# Altium project Breadboard_PS_v1-0.PrjPcb
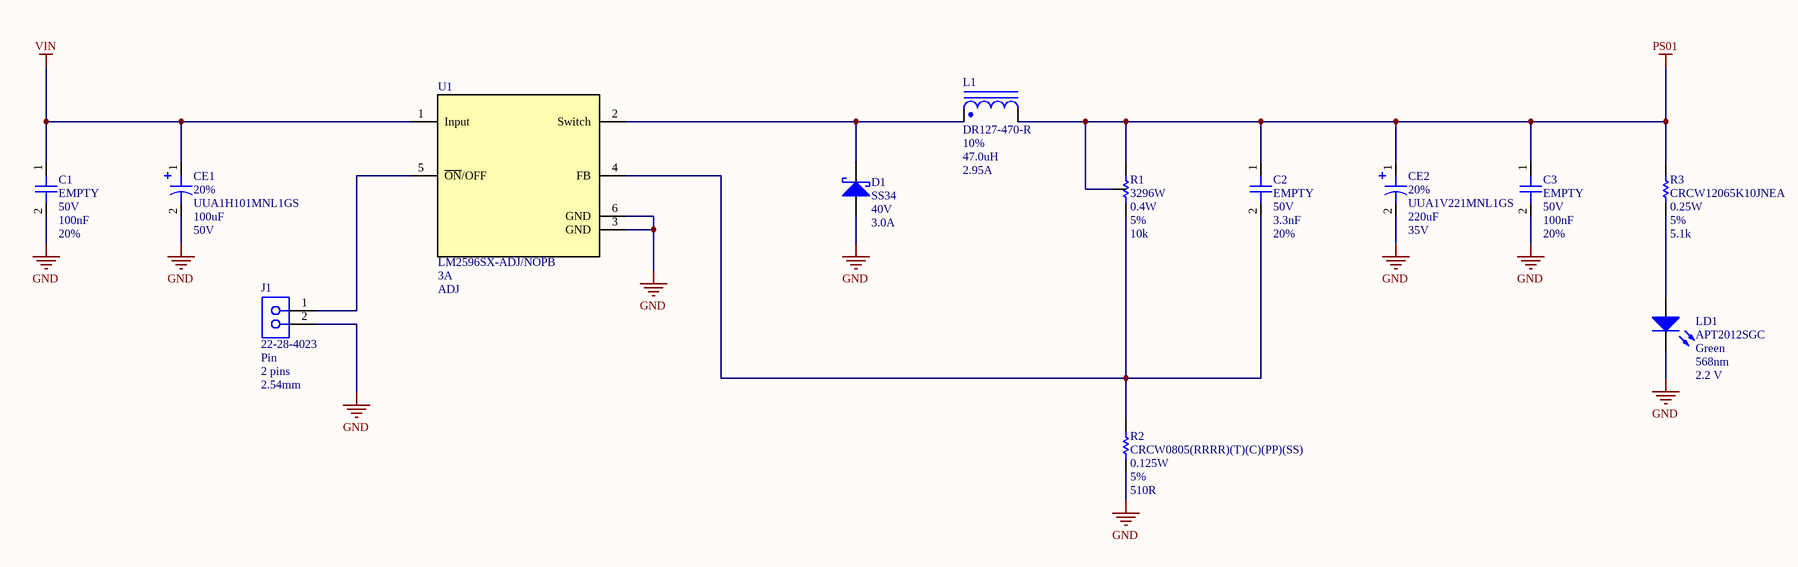
[diagram p0: BPS_PowerSupply_v1-0.SchDoc]
4 sheets, 29 parts. Net scope: global (net labels, ports and power ports of the same name join across sheets).
Board file: BPS_PCB_v1-0.PcbDoc
Sheets:
  BPS_Title_v1-0.SchDoc
  BPS_PowerSupply_v1-0.SchDoc
  BPS_PowerOutput_v1-0.SchDoc
  BPS_PowerInput_v1-0.SchDoc

## Sheet BPS_Title_v1-0.SchDoc
size A4

## Sheet BPS_PowerSupply_v1-0.SchDoc
size A3

### Parts
C1  value 100nF  PartNumber1: EMPTY  Voltage: 50V  Tolerance: 20%  [Cap0805]  (hidden comment: WCAP-CSGP (0805))
C2  value 3.3nF  PartNumber1: EMPTY  Voltage: 50V  Tolerance: 20%  [Cap0805]  (hidden comment: WCAP-CSGP (0805))
C3  value 100nF  PartNumber1: EMPTY  Voltage: 50V  Tolerance: 20%  [Cap0805]  (hidden comment: WCAP-CSGP (0805))
CE1  value 100uF  Tolerance: 20%  PartNumber1: UUA1H101MNL1GS  Voltage: 50V  [10.0dia(10.0)]  (hidden comment: 50V 100uF)
CE2  value 220uF  Tolerance: 20%  PartNumber1: UUA1V221MNL1GS  Voltage: 35V  [10.0dia(10.0)]  (hidden comment: 35V 220uF)
D1  Vrrm: 40V  If: 3.0A  [DO-214AA]  (hidden comment: SS34)
J1  Type: Pin  Pins: 2 pins  Pitch: 2.54mm  [CONSIL02STRMALE_100_100]  (hidden comment: 22-28-4023)
L1  value 47.0uH  PartNumber1: DR127-470-R  Tolerance: 10%  Current: 2.95A  [DR127]  (hidden comment: DR127)
LD1  Colour: Green  Wavelength: 568nm  Vled: 2.2 V  [LED0805]  (hidden comment: APT2012SGC)
R1  value 10k  Power: 0.4W  Tolerance: 5%  [3296W]  (hidden comment: 3296W)
R2  value 510R  PartNumber1: CRCW0805(RRRR)(T)(C)(PP)(SS)  Power: 0.125W  Tolerance: 5%  [RES0805]  (hidden comment: Chip Resistor)
R3  value 5.1k  PartNumber1: CRCW12065K10JNEA  Power: 0.25W  Tolerance: 5%  [RES1206]  (hidden comment: Chip Resistor)
U1  Current: 3A  Voltage: ADJ  [TO-263-5]  (hidden comment: LM2596SX-ADJ/NOPB)

### Nets
GND: C1.2 C3.2 CE1.2 CE2.2 D1.A J1.2 LD1.K R2.1 U1.3(GND) U1.6(GND)
PS01: C2.1 C3.1 CE2.1 L1.2 R1.2 R1.3 R3.2
VIN: C1.1 CE1.1 U1.1(Input)
NetC2_2: C2.2 R1.1 R2.2 U1.4(FB)
NetD1_K: D1.K L1.1 U1.2(Switch)
NetJ1_1: J1.1 U1.5(~{ON}/OFF)
NetLD1_A: LD1.A R3.1

### Notes on the sheet
- Title
- Author
- Checked By
- Size:
- Revision:
- A3
- Date:
- Project
- Time:
- Sheet
- of
- File:

### Library data of the parts
C1-C3 = WCAP-CSGP (0805): Surface Mount Multilayer Ceramic Chip Capacitors  for Commercial Applications; Manufacturer1: Wurth; Published: 19-Jun-2016; LatestRevisionDate: 19-Jun-2016; Publisher: Lucas Moraes; PackageReference: CAP0805; PackageDescription: CAP0805;2 Leads
CE1 = 50V 100uF: Electrolytic Capacitor SMD; Manufacturer1: Nichicon; Code: 101; Published: 05-Sep-2021; LatestRevisionDate: 05-Sep-2021; PackageReference: 8.0dia(10.0); Publisher: Lucas Moraes; PackageDescription: 10.0dia(10.0)2 leads; LatestRevisionNote: Created
CE2 = 35V 220uF: Electrolytic Capacitor SMD; Manufacturer1: Nichicon; Code: 221; Published: 06-Sep-2021; LatestRevisionDate: 06-Sep-2021; PackageReference: 10.0dia(10.0); Publisher: Lucas Moraes; PackageDescription: 10.0dia(10.0);2 leads; LatestRevisionNote: Created
D1 = SS34: Schottky Barrier Rectifiers 40V 3.0A; Manufacturer1: On Semiconductor; Vf: 0.85V; Published: 24-May-2022; LatestRevisionDate: 20-Jun-2016; PackageReference: DO-214AA; Publisher: Lucas Moraes; PackageDescription: DO-214AA; 2 Leads; PartNumber1: SS34
J1 = 22-28-4023: Headers & Wire Housings 02 MODII HDR SRST B/A .100CL; Manufacturer1: Molex; LastRevisionNote: Created; Gender: Male; Published: 15-Set-2017; LatestRevisionDate: 27-Mar-2023; PackageReference: CONSIL02STRMALE_100_100; Publisher: Lucas Moraes; PackageDescription: CONSIL02STRMALE_100_100; 2 Leads; PartNumber1: 22-28-4023
L1 = DR127: High power density, high efficiency, low profile shielded drum core power inductors; Manufacturer1: Coiltronics / Eaton; LatestRevisionDate: 05-Apr-2023; PackageReference: DR127; Publisher: Lucas Moraes; PackageDescription: DR127; 2 Leads; Published: 05-Apr-2023; Datasheet: https://br.mouser.com/datasheet/2/87/eaton-dr-high-power-density-high-efficiency-shield-1608690.pdf
LD1 = APT2012SGC: Standard LEDs - SMD 0805 Green; Manufacturer1: Kingbright; LastRevisionNote: Created; Published: 29-Dec-2016; PackageReference: LED0805; Publisher: Lucas Moraes; PackageDescription: LED0805; 2 leads; LastRevision: 29-Dec-2016; Datasheet: http://www.us.kingbright.com/images/catalog/SPEC/APT2012SGC.pdf; PartNumber1: APT2012SGC
R1 = 3296W: Trimmer Resistors - Through Hole 3/8" 100Kohms Sealed Vertical Adjust; Manufacturer1: Bourns; Published: 22-May-2017; LatestRevisionDate: 22-May-2017; PackageReference: 3296W; Publisher: Lucas Moraes; PackageDescription: 3386F; 3 Leads; PartNumber1: 3296W
R2 = CRCW0805: Thick Film Chip Resistors with CECC Approval,  available with Established Reliability; LatestRevisionDate: 06-May-2016; PackageReference: 0805; Publisher: Lucas Moraes; PackageDescription: SMD 0805; 2 Leads; Published: 06-May-2016
R3 = CRCW1206: Thick Film Chip Resistors with CECC Approval,  available with Established Reliability; LatestRevisionDate: 06-May-2016; PackageReference: 1206; Publisher: Lucas Moraes; PackageDescription: SMD 1206; 2 Leads; Published: 06-May-2016
U1 = LM2596SX-ADJ/NOPB: Switching Voltage Regulators 4V to 40V, 3A Step-Up Wide Vin Flyback Regulator 5-DDPAK/TO-263 -40 to 125; Manufacturer1: Texas Instruments; Published: 09-Agu-2022; LatestRevisionDate: 09-Agu-2022; LatestRevisionNote: Created; PackageReference: TO-263-5; Publisher: Lucas Moraes; PackageDescription: TO-263-5;5 Leads; PartNumber1: LM2596SX-ADJ/NOPB

## Sheet BPS_PowerOutput_v1-0.SchDoc
size A3
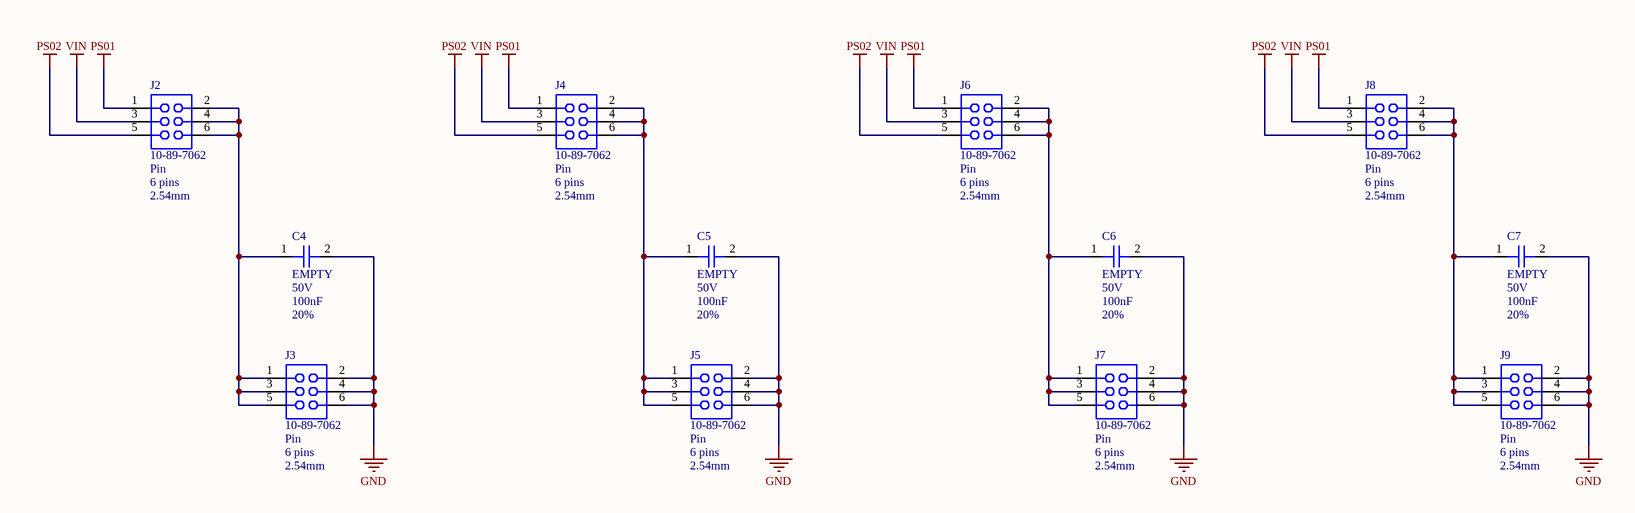
[diagram p1: BPS_PowerOutput_v1-0.SchDoc]

### Parts
C4  value 100nF  PartNumber1: EMPTY  Voltage: 50V  Tolerance: 20%  [Cap0805]  (hidden comment: WCAP-CSGP (0805))
C5  value 100nF  PartNumber1: EMPTY  Voltage: 50V  Tolerance: 20%  [Cap0805]  (hidden comment: WCAP-CSGP (0805))
C6  value 100nF  PartNumber1: EMPTY  Voltage: 50V  Tolerance: 20%  [Cap0805]  (hidden comment: WCAP-CSGP (0805))
C7  value 100nF  PartNumber1: EMPTY  Voltage: 50V  Tolerance: 20%  [Cap0805]  (hidden comment: WCAP-CSGP (0805))
J2  Type: Pin  Pins: 6 pins  Pitch: 2.54mm  [CONDIL06STRMALE_100_100]  (hidden comment: 10-89-7062)
J3  Type: Pin  Pins: 6 pins  Pitch: 2.54mm  [CONDIL06STRMALE_100_100]  (hidden comment: 10-89-7062)
J4  Type: Pin  Pins: 6 pins  Pitch: 2.54mm  [CONDIL06STRMALE_100_100]  (hidden comment: 10-89-7062)
J5  Type: Pin  Pins: 6 pins  Pitch: 2.54mm  [CONDIL06STRMALE_100_100]  (hidden comment: 10-89-7062)
J6  Type: Pin  Pins: 6 pins  Pitch: 2.54mm  [CONDIL06STRMALE_100_100]  (hidden comment: 10-89-7062)
J7  Type: Pin  Pins: 6 pins  Pitch: 2.54mm  [CONDIL06STRMALE_100_100]  (hidden comment: 10-89-7062)
J8  Type: Pin  Pins: 6 pins  Pitch: 2.54mm  [CONDIL06STRMALE_100_100]  (hidden comment: 10-89-7062)
J9  Type: Pin  Pins: 6 pins  Pitch: 2.54mm  [CONDIL06STRMALE_100_100]  (hidden comment: 10-89-7062)

### Nets
GND: C4.2 C5.2 C6.2 C7.2 J3.2 J3.4 J3.6 J5.2 J5.4 J5.6 J7.2 J7.4 J7.6 J9.2 J9.4 J9.6
PS01: J2.1 J4.1 J6.1 J8.1
PS02: J2.5 J4.5 J6.5 J8.5
VIN: J2.3 J4.3 J6.3 J8.3
NetC4_1: C4.1 J2.2 J2.4 J2.6 J3.1 J3.3 J3.5
NetC5_1: C5.1 J4.2 J4.4 J4.6 J5.1 J5.3 J5.5
NetC6_1: C6.1 J6.2 J6.4 J6.6 J7.1 J7.3 J7.5
NetC7_1: C7.1 J8.2 J8.4 J8.6 J9.1 J9.3 J9.5

### Notes on the sheet
- Title
- Author
- Checked By
- Size:
- Revision:
- A3
- Date:
- Project
- Time:
- Sheet
- of
- File:

### Library data of the parts
C4-C7 = WCAP-CSGP (0805): as C1 on sheet BPS_PowerSupply_v1-0; Published: 19-Jun-2016; LatestRevisionDate: 19-Jun-2016; Publisher: Lucas Moraes; PackageReference: CAP0805; PackageDescription: CAP0805;2 Leads
J2-J9 = 10-89-7062: Headers & Wire Housings C-Grid PCB Conn SR V onn SR Vt Tn-A 8Ckt; Manufacturer1: Molex; LastRevisionNote: Created; Gender: Male; Direction: 180; Published: 12-Sep-2017; LatestRevisionDate: 12-Sep-2017; PackageReference: CONDIL6; Publisher: Douglas Alves; PackageDescription: CONDIL6; 6 Leads; PartNumber1: 10-89-7062

## Sheet BPS_PowerInput_v1-0.SchDoc
size A3
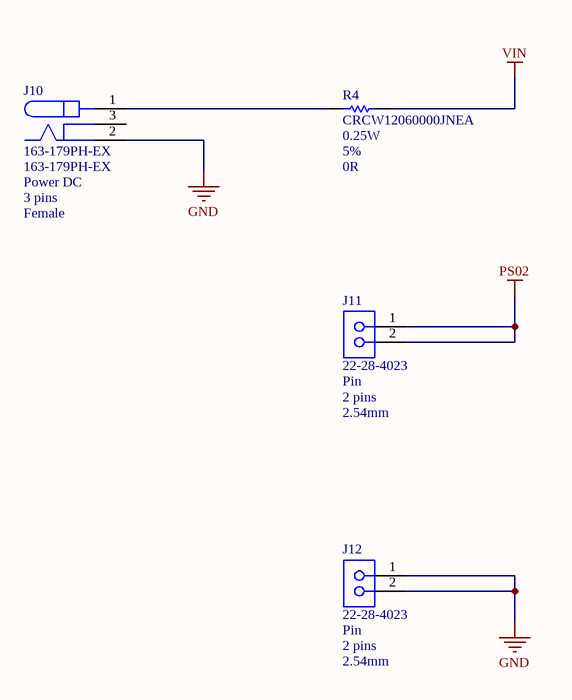
[diagram p2: BPS_PowerInput_v1-0.SchDoc]

### Parts
J10  163-179PH-EX  Type: Power DC  Pins: 3 pins  Gender: Female  [PowerJack_2.1_5.5]
J11  Type: Pin  Pins: 2 pins  Pitch: 2.54mm  [CONSIL02STRMALE_100_100]  (hidden comment: 22-28-4023)
J12  Type: Pin  Pins: 2 pins  Pitch: 2.54mm  [CONSIL02STRMALE_100_100]  (hidden comment: 22-28-4023)
R4  value 0R  PartNumber1: CRCW12060000JNEA  Power: 0.25W  Tolerance: 5%  [RES1206]  (hidden comment: Chip Resistor)

### Nets
GND: J10.2 J12.1 J12.2
PS02: J11.1 J11.2
VIN: R4.1
NetJ10_1: J10.1 R4.2

Not connected (* = marked no-connect by the designer): J10 3

### Notes on the sheet
- Title
- Author
- Checked By
- Size:
- Revision:
- A3
- Date:
- Project
- Time:
- Sheet
- of
- File:

### Library data of the parts
J10 = 163-179PH-EX: DC Power Connectors PCB 2.1MM; Manufacturer1: Kobiconn; Published: 04-Dec-2022; LatestRevisionDate: 04-Dec-2022; PackageReference: PowerJack_2.1_5.5; Publisher: Lucas Moraes; PackageDescription: PowerJack_2.1_5.5; 3 Leads; PartNumber1: 163-179PH-EX
J11 J12 = 22-28-4023: as J1 on sheet BPS_PowerSupply_v1-0; Published: 15-Set-2017; LatestRevisionDate: 27-Mar-2023; PackageReference: CONSIL02STRMALE_100_100; Publisher: Lucas Moraes; PackageDescription: CONSIL02STRMALE_100_100; 2 Leads; PartNumber1: 22-28-4023
R4 = CRCW1206: as R3 on sheet BPS_PowerSupply_v1-0; LatestRevisionDate: 06-May-2016; PackageReference: 1206; Publisher: Lucas Moraes; PackageDescription: SMD 1206; 2 Leads; Published: 06-May-2016

## Nets that join several sheets
GND: BPS_PowerSupply_v1-0 (10 pins), BPS_PowerOutput_v1-0 (16 pins), BPS_PowerInput_v1-0 (J10.2 J12.1 J12.2)
PS01: BPS_PowerSupply_v1-0 (7 pins), BPS_PowerOutput_v1-0 (J2.1 J4.1 J6.1 J8.1)
PS02: BPS_PowerOutput_v1-0 (J2.5 J4.5 J6.5 J8.5), BPS_PowerInput_v1-0 (J11.1 J11.2)
VIN: BPS_PowerSupply_v1-0 (C1.1 CE1.1 U1.1), BPS_PowerOutput_v1-0 (J2.3 J4.3 J6.3 J8.3), BPS_PowerInput_v1-0 (R4.1)